# EAGLE design ArduinoUNOGamePlatform (EAGLE 9.4.2)
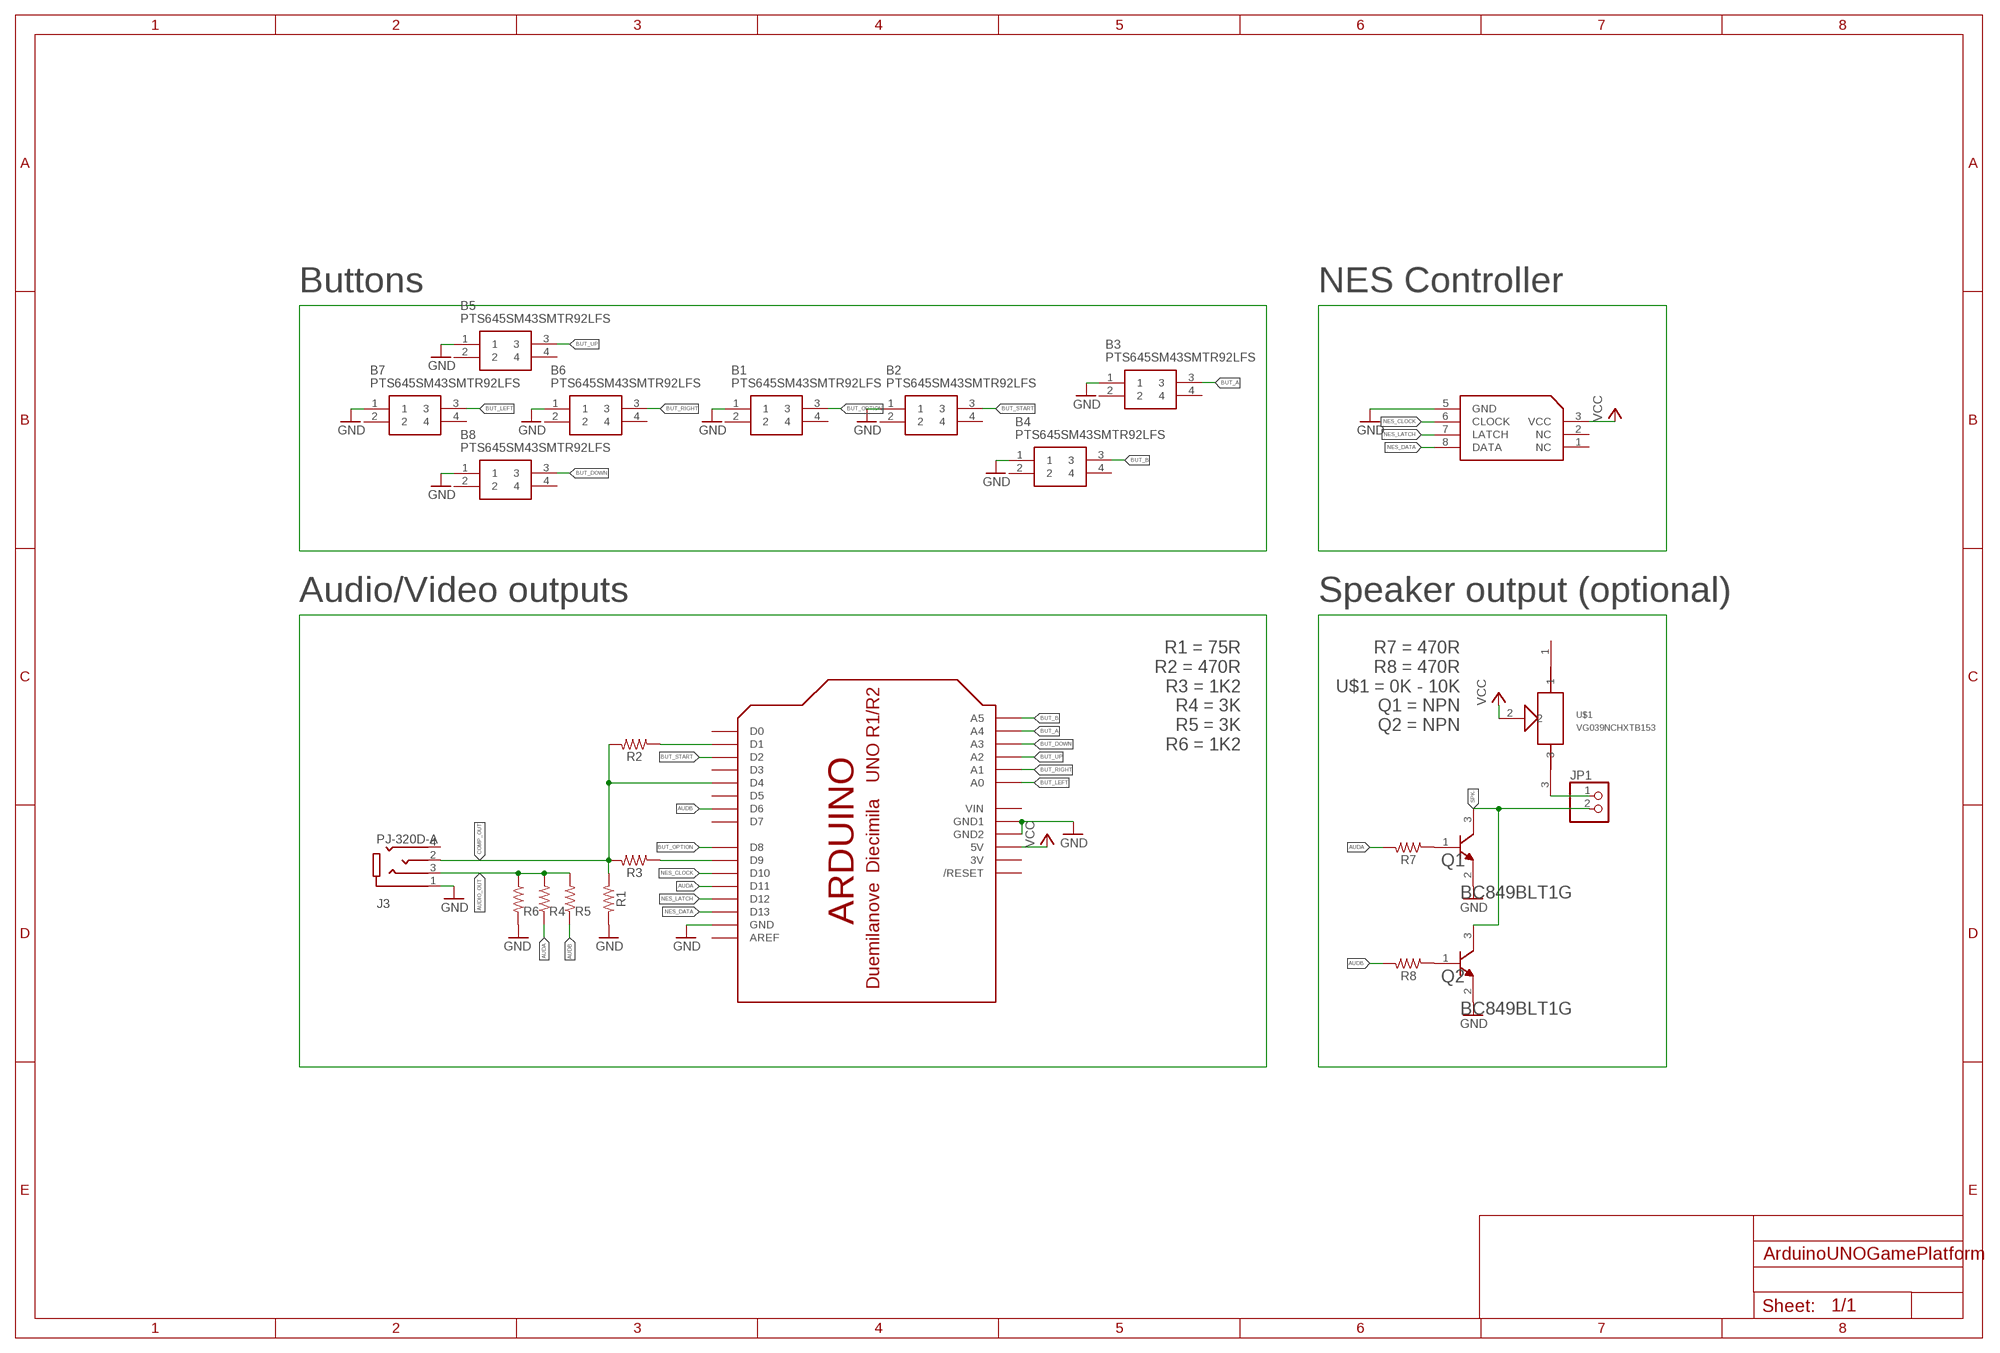
[diagram p0: schematic, sheet 1]

## Parts
B1  PTS645SM43SMTR92LFS  [PTS645(SMT)]
B2  PTS645SM43SMTR92LFS  [PTS645(SMT)]
B3  PTS645SM43SMTR92LFS  [PTS645(SMT)]
B4  PTS645SM43SMTR92LFS  [PTS645(SMT)]
B5  PTS645SM43SMTR92LFS  [PTS645(SMT)]
B6  PTS645SM43SMTR92LFS  [PTS645(SMT)]
B7  PTS645SM43SMTR92LFS  [PTS645(SMT)]
B8  PTS645SM43SMTR92LFS  [PTS645(SMT)]
J3  PJ-320D-A  [HRO_PJ-320D-A]
JP1  PINHD-1X2  [1X02]
Q1  ON_SEMICONDUCTOR_BC849BLT1GON_SEMICONDUCTOR_BC849BLT1G_0_0  [ON_SEMICONDUCTOR_BC849BLT1G_0]
Q2  ON_SEMICONDUCTOR_BC849BLT1GON_SEMICONDUCTOR_BC849BLT1G_0_0  [ON_SEMICONDUCTOR_BC849BLT1G_0]
R1  75R  52101-101-REV-A_RC-MASTER-SMD_R_0603MP  [52101-101-REV-A_RC-MASTER-SMD_R0603MP]
R2  220R  52101-101-REV-A_RC-MASTER-SMD_R_0603MP  [52101-101-REV-A_RC-MASTER-SMD_R0603MP]
R3  1K2  52101-101-REV-A_RC-MASTER-SMD_R_0603MP  [52101-101-REV-A_RC-MASTER-SMD_R0603MP]
R4  3K  52101-101-REV-A_RC-MASTER-SMD_R_0603MP  [52101-101-REV-A_RC-MASTER-SMD_R0603MP]
R5  3K  52101-101-REV-A_RC-MASTER-SMD_R_0603MP  [52101-101-REV-A_RC-MASTER-SMD_R0603MP]
R6  1K2  52101-101-REV-A_RC-MASTER-SMD_R_0603MP  [52101-101-REV-A_RC-MASTER-SMD_R0603MP]
R7  470R  52101-101-REV-A_RC-MASTER-SMD_R_0603MP  [52101-101-REV-A_RC-MASTER-SMD_R0603MP]
R8  470R  52101-101-REV-A_RC-MASTER-SMD_R_0603MP  [52101-101-REV-A_RC-MASTER-SMD_R0603MP]
U$1  VG039NCHXTB153  [VG039NCHXTB101]
U$2  ARDUINO-BPLACE  [ARDUINO-BPLACE]
U$3  NES-CONTROLLER-PORT  [NES-CONTROLLER-SOCKET]

## Nets
AUDA: R4.1 R7.2 U$2.D11
AUDB: R5.1 R8.2 U$2.D6
AUDIO_OUT: J3.3(RING1) R4.2 R5.2 R6.1
BUT_A: B3.3 U$2.A4
BUT_B: B4.3 U$2.A5
BUT_DOWN: B8.3 U$2.A3
BUT_LEFT: B7.3 U$2.A0
BUT_OPTION: B1.3 U$2.D8
BUT_RIGHT: B6.3 U$2.A1
BUT_START: B2.3 U$2.D2
BUT_UP: B5.3 U$2.A2
COMP_OUT: J3.2(TIP) R1.1 R2.2 R3.2 U$2.D4
GND: B1.1 B2.1 B3.1 B4.1 B5.1 B6.1 B7.1 B8.1 J3.1(SLEEVE) Q1.2(E) Q2.2(E) R1.2 R6.2 U$2.GND U$2.GND1 U$2.GND2 U$3.5(GND)
N$1: JP1.1 U$1.3
N$7: Q2.1(B) R8.1
N$8: Q1.1(B) R7.1
NES_CLOCK: U$2.D10 U$3.6(CLOCK)
NES_DATA: U$2.D13 U$3.8(DATA)
NES_LATCH: U$2.D12 U$3.7(LATCH)
SPK-: JP1.2 Q1.3(C) Q2.3(C)
SYNC_OUT: R3.1 U$2.D9
VCC: U$1.2 U$2.5V U$3.3(VCC)
VIDEO_OUT: R2.1 U$2.D1
Unconnected: B1.2 B1.4 B2.2 B2.4 B3.2 B3.4 B4.2 B4.4 B5.2 B5.4 B6.2 B6.4 B7.2 B7.4 B8.2 B8.4 J3.4(RING2) U$1.1 U$2.AREF U$2.D0 U$2.D3 U$2.D5 U$2.D7 U$2.RESET(/RESET) U$3.1(NC) U$3.2(NC)

## Notes on the sheet
- Buttons | NES Controller
- Audio/Video outputs | Speaker output (optional)
- R1 = 75R
  R2 = 470R
  R3 = 1K2
  R4 = 3K
  R5 = 3K
  R6 = 1K2
- R7 = 470R
  R8 = 470R
  U$1 = 0K - 10K
  Q1 = NPN
  Q2 = NPN

## Power pins joined to a net without a drawn wire
3V: U$2.3V
VIN: U$2.VIN

## Library data of the parts
B1-B8 = PTS645SM43SMTR92LFS:PTS645SM43SMTR92LFS: C & K COMPONENTS - PTS645SM43SMTR92LFS - SWITCH, SPST, 0.05A, 12VDC, SMD, 4.3MM Source: Datasheet <http://www.farnell.com/datasheets/1914518.pdf>; DESCRIPTION: C & K COMPONENTS - PTS645SM43SMTR92LFS - SWITCH, SPST, 0.05A, 12VDC, SMD, 4.3MM; HEIGHT: mm; MANUFACTURER_NAME: C & K COMPONENTS; MANUFACTURER_PART_NUMBER: PTS645SM43SMTR92LFS; MOUSER_PART_NUMBER: 611-PTS645SM43SMTR92; MOUSER_PRICE-STOCK: https://www.mouser.com/Search/Refine.aspx?Keyword=611-PTS645SM43SMTR92
J3 = PJ-320D-A:PJ-320D-A: Check availability <https://pricing.snapeda.com/parts/PJ-320D-A/HRO%20Electronics%20Co.%2C%20Ltd./view-part?ref=eda>; AVAILABILITY: Not in stock; CHECK_PRICES: https://www.snapeda.com/parts/PJ-320D-A/HRO+Electronics+Co.%252C+Ltd./view-part/?ref=eda; DESCRIPTION: Headphone jack 0.5A 30V DC 100 mΩ; MF: HRO Electronics Co., Ltd.; MP: PJ-320D-A; PACKAGE: Package; PRICE: None; SNAPEDA_LINK: https://www.snapeda.com/parts/PJ-320D-A/HRO+Electronics+Co.%252C+Ltd./view-part/?ref=snap
JP1 = pinhead:PINHD-1X2: PIN HEADER
Q1 Q2 = On Semiconductor - BC849BLT1G:ON_SEMICONDUCTOR_BC849BLT1G: ONSC-NPN-B1E2C3-3; CIIVA_IDS: 19369299; COMPONENT_LINK_1_DESCRIPTION: Manufacturer URL; COMPONENT_LINK_1_URL: http://www.onsemi.com/; COMPONENT_LINK_3_DESCRIPTION: Package Specification; COMPONENT_LINK_3_URL: http://www.onsemi.cn/pub_link/Collateral/318-08.PDF; DATASHEET: http://www.onsemi.cn/pub_link/Collateral/BC846ALT1-D.PDF; DATASHEET_VERSION: Rev. 11; FOOTPRINT_VARIANT_NAME_0: Manufacturer Recommended; FT_MIN_MHZ: 100; IC_CONTINUOUS_A: 0.1; IMPORTED: yes; IMPORTED_FROM: vault; IMPORT_TS: 1521843736; MF: On Semiconductor; MOUNTING_TECHNOLOGY: Surface Mount; MPN: BC849BLT1G; PACKAGE: SOT-23-3-318-08; PACKAGE_DESCRIPTION: 3-Pin Small Outline Transistor, Body 2.92 x 1.3 mm, Pitch 0.95 mm; PACKAGE_VERSION: Rev. AP, 11/2009; PACKING: Tape and Reel; POLARITY: NPN; PREFIX: Q; RELEASE_DATE: 1406898388; ROHS: Yes; VAULT_GUID: 19D3C7D6-08FD-4A81-9BD4-62C7617130FB; VAULT_REVISION: B4675A61-FAF7-4072-9C56-0A9635A35669
R1-R8 = ESP32_DMX_Audio:52101-101-REV-A_RC-MASTER-SMD_R_: RESISTOR
U$1 = untitled:VG039NCHXTB153
U$2 = adafruit:ARDUINO: Arduino Diecimila/Duemilanove Make a shield with ease, this package has all the named pins as well as the two mounting drill holes and an outline of the USB and DC power connector. The outline is on the DIMENSION layer, so if your board house uses it they will cut the outline to match. http://www.ladyada.net/library/pcb/eaglelibrary.html
U$3 = PJ-320D-A:NES-CONTROLLER-PORT

## Board
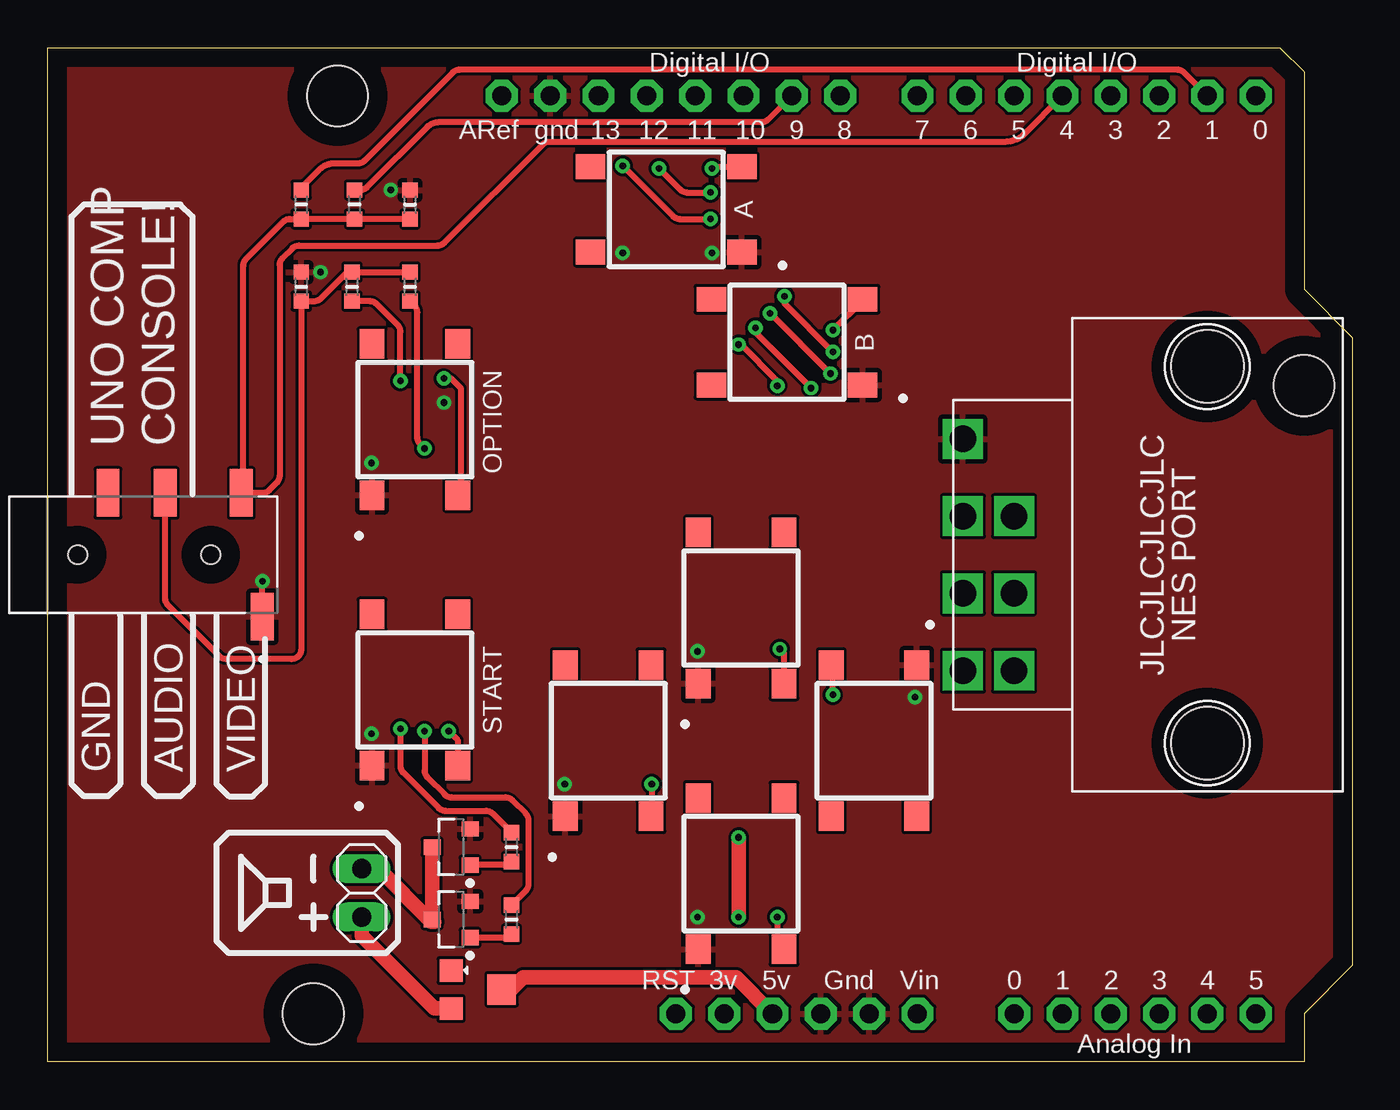
[diagram p1: board, top side]
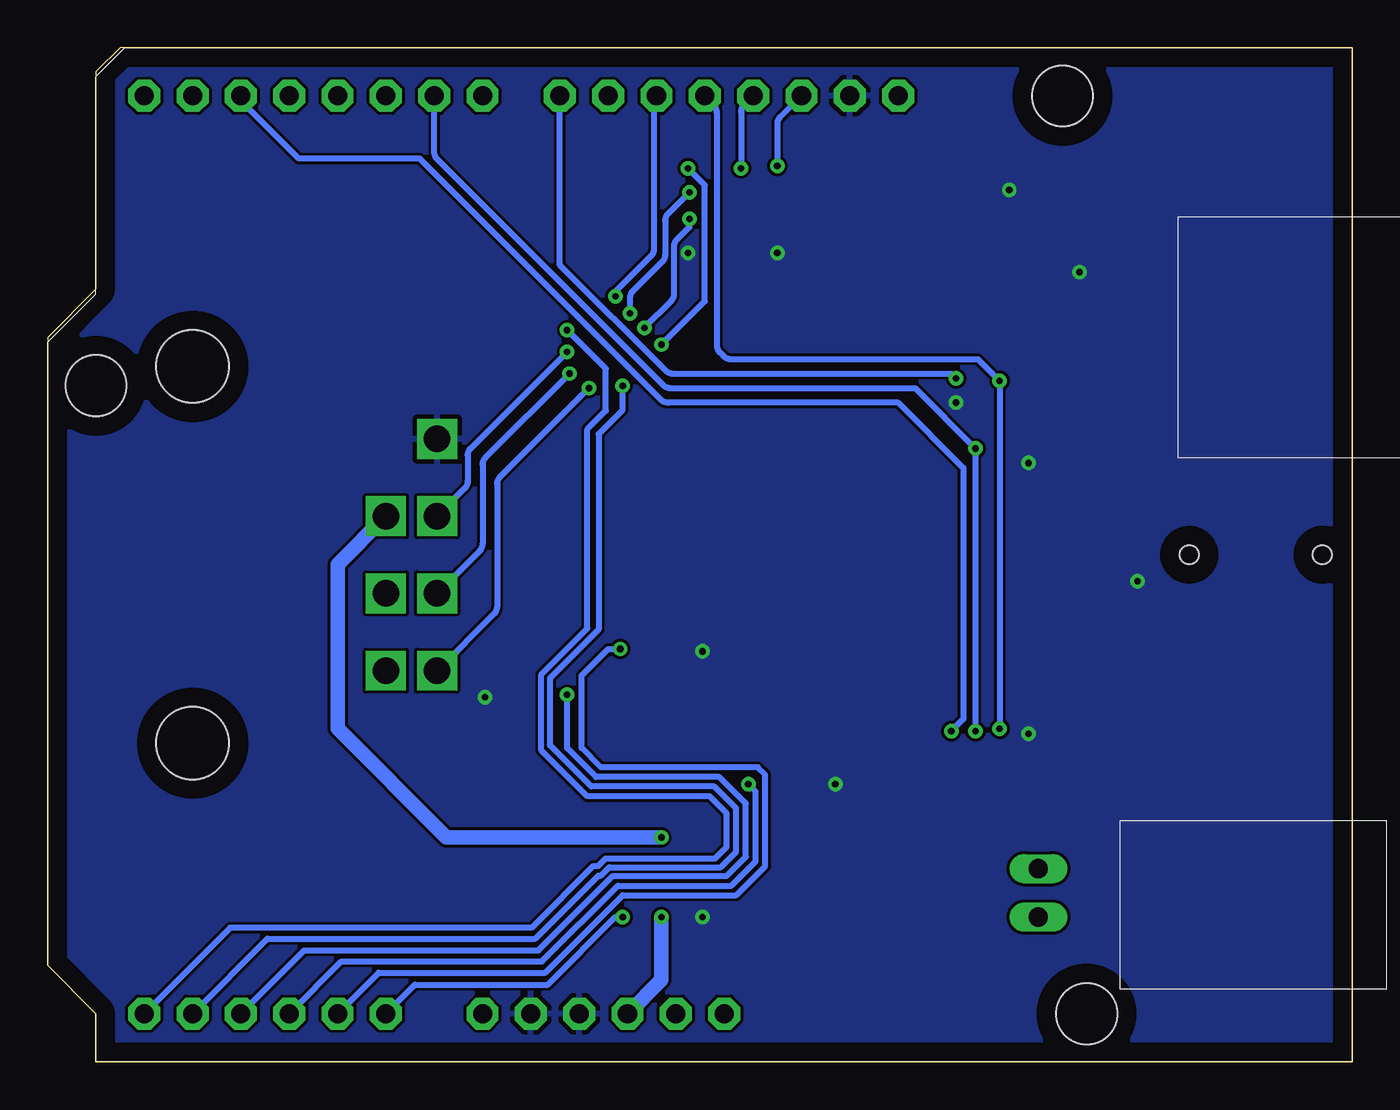
[diagram p2: board, bottom side, seen from below]

Size 68.58 x 53.34 mm. Coordinates in mm from the lower left corner, seen from the top.
Outline: 0,53.34 64.77,53.34 66.04,52.07 66.04,40.64 68.58,38.1 68.58,5.08 66.04,2.54 66.04,0 0,0 0,53.34
Copper layers (1*16): Top 0.035mm / dielectric 0.15mm / Bottom 0.035mm
Design rules "default": minimum track width 6mil, minimum drill 0.35mm, track to track 6mil, track to pad 6mil, pad to pad 6mil, via to via 6mil, smd to smd 6mil, copper to edge 40mil, drill to drill 6mil, minimum pad ring 10mil, minimum via ring 8mil, stop-mask expansion 4mil, vias tented up to drill 0mil, thermal gap 10mil

### Footprints (pad centres in the part's own frame; a part is rotated, then mirrored left to right if it is on the bottom)
PTS645(SMT) = smd 1.55 x 1.3: 1 -3.975,2.25; 2 3.975,2.25; 3 -3.975,-2.25; 4 3.975,-2.25
HRO_PJ-320D-A = smd 1.2 x 2.5: 1 6.2,-3.25; 2 5.1,3.25; 3 1.1,3.25; 4 -1.9,3.25 | hole 1: -3.5,0; 3.5,0
1X02 = drill 1.016 long: 1 -1.27,0; 2 1.27,0
ON_SEMICONDUCTOR_BC849BLT1G_0 = smd 0.9 x 0.8: 1 -1,0.95; 2 -1,-0.95; 3 1,0
52101-101-REV-A_RC-MASTER-SMD_R0603MP = smd 0.8 x 0.8: 1 -0.762,0; 2 0.762,0
VG039NCHXTB101 = smd 1.2 x 1.2: 1 -1,-1.65; 3 1,-1.65 | smd 1.6 x 1.5: 2 0,1
ARDUINO-BPLACE = drill 1 pad 1.676 octagon: 3V 35.56,2.54; 5V 38.1,2.54; A0 50.8,2.54; A1 53.34,2.54; A2 55.88,2.54; A3 58.42,2.54; A4 60.96,2.54; A5 63.5,2.54; AREF 23.876,50.8; D0 63.5,50.8; D1 60.96,50.8; D2 58.42,50.8; D3 55.88,50.8; D4 53.34,50.8; D5 50.8,50.8; D6 48.26,50.8; D7 45.72,50.8; D8 41.656,50.8; D9 39.116,50.8; D10 36.576,50.8; D11 34.036,50.8; D12 31.496,50.8; D13 28.956,50.8; GND 26.416,50.8; GND1 43.18,2.54; GND2 40.64,2.54; RESET 33.02,2.54; VIN 45.72,2.54 | hole 3.2: 15.24,50.8; 66.04,35.56; 13.97,2.54
NES-CONTROLLER-SOCKET = drill 1.4 square: 1 6.096,-10.16; 2 2.032,-10.16; 3 -2.032,-10.16; 5 -6.096,-12.852; 6 -2.032,-12.852; 7 2.032,-12.852; 8 6.096,-12.852 | hole 3.8: -9.906,0; 9.906,0

### Placement (x,y rotation side)
B1  19.3,33.78 90 top
B2  19.3,19.56 90 top
B3  32.51,44.83 180 top
B4  38.86,37.85 180 top
B5  29.46,16.89 90 top
B6  36.45,23.88 90 top
B7  36.45,9.91 90 top
B8  43.43,16.89 270 top
J3  5.08,26.67 0 top
JP1  16.51,8.89 90 top
Q1  21.21,11.3 180 top
Q2  21.21,7.49 180 top
R1  19.05,45.09 90 top
R2  13.34,45.09 270 top
R3  16.13,45.09 270 top
R4  16,40.77 90 top
R5  19.05,40.77 90 top
R6  13.34,40.77 90 top
R7  24.38,11.3 90 top
R8  24.38,7.49 90 top
U$1  22.86,3.81 270 top
U$2  0,0 0 top
U$3  60.96,26.67 270 top

### Tracks (layer width: path | path; a pad name or v marks a point on that pad's centre or on a via)
AUDA  (via drill 0.35)
  Top 0.305: R7.2 23.39,13.06 arc45 23.03,13.21 20.91,13.21 arc-45 20.55,13.36 18.69,15.22 arc-45 18.54,15.58 v18.54,17.53 | v18.54,35.81 18.54,38.4 arc45 18.39,38.76 17.29,39.86 arc45 16.93,40.01 R4.1
  Bottom 0.305: U$2.D11 33.68,50.44 arc45 33.4,49.77 33.4,37.67 arc-45 33.25,37.32 33.04,37.11 arc-45 32.68,36.96 19.68,36.96 v18.54,35.81 v18.54,17.53
AUDB  (via drill 0.35)
  Top 0.305: R8.2 25.12,8.99 arc45 25.27,9.35 25.27,12.71 arc45 25.12,13.06 24.42,13.76 arc45 24.07,13.91 21.22,13.91 arc-45 20.86,14.06 19.96,14.96 arc-45 19.81,15.32 v19.81,17.4 | v19.81,32.26 19.58,32.49 arc-45 19.43,32.85 19.43,39.41 arc45 19.28,39.77 R5.1
  Bottom 0.305: U$2.D6 48.26,47.84 arc-45 48.11,47.48 36.22,35.58 arc-45 35.86,35.43 22.99,35.43 v19.81,32.26 v19.81,17.4
AUDIO_OUT
  Top 0.305: J3.3 6.18,24.38 arc45 6.33,24.02 9.01,21.34 arc45 9.37,21.19 12.83,21.19 arc90 13.34,21.7 R6.1 14.01,40.01 arc45 14.37,40.15 15.75,41.53 R4.2 R5.2
BUT_A  (via drill 0.35)
  Top 0.305: v38.35,35.56 38.35,35.81 36.45,37.72 v36.32,37.72 | v34.92,46.99 35.02,47.08 B3.3
  Bottom 0.305: U$2.A4 57.02,6.48 42.95,6.48 39.64,9.79 39.51,9.79 39.06,10.24 33.19,10.24 32.38,11.05 32.38,13.34 33.53,14.48 40.01,14.48 42.16,16.64 42.16,20.19 39.62,22.73 39.62,33.02 38.35,34.29 v38.35,35.56 | v34.92,46.99 34.04,46.1 34.04,40.01 v36.32,37.72
BUT_B  (via drill 0.35)
  Top 0.305: B4.3 42.84,40.04 v41.27,38.48
  Bottom 0.305: U$2.A5 58.98,7.06 43.14,7.06 39.9,10.3 39.64,10.3 39.25,10.7 33.5,10.7 32.89,11.3 32.89,13.08 33.78,13.97 40.21,13.97 42.62,16.38 42.62,20.38 40.21,22.8 40.21,33.27 39.24,34.24 39.24,36.45 v41.27,38.48
BUT_DOWN  (via drill 0.35)
  Top 0.305: v41.27,19.3 41.27,20.77 B8.3
  Bottom 0.305: U$2.A3 55.09,5.87 42.78,5.87 38.87,9.79 32.89,9.79 31.88,10.79 31.88,13.59 33.27,14.99 39.75,14.99 41.27,16.51 v41.27,19.3
BUT_LEFT  (via drill 0.35)
  Top 0.305: v38.35,7.62 38.35,6.28 B7.3
  Bottom 0.305: U$2.A0 49.28,4.06 42.29,4.06 38.73,7.62 v38.35,7.62
BUT_OPTION  (via drill 0.35)
  Top 0.305: v20.83,35.94 21.21,35.94 21.72,35.43 21.72,29.97 B1.3
  Bottom 0.305: v20.83,35.94 21.08,36.2 35.73,36.2 arc45 36.09,36.34 41.66,41.91 U$2.D8
BUT_RIGHT  (via drill 0.35)
  Top 0.305: v38.48,21.72 38.7,21.5 B6.3
  Bottom 0.305: U$2.A1 51.18,4.7 42.42,4.7 38.35,8.76 32.38,8.76 30.86,10.29 30.86,15.11 31.24,15.49 39.5,15.49 40.51,16.51 40.51,20.32 39.12,21.72 v38.48,21.72
BUT_START  (via drill 0.35)
  Top 0.305: v21.08,17.4 21.55,16.93 B2.3
  Bottom 0.305: U$2.D2 58.42,50.55 55.37,47.5 49.02,47.5 36.34,34.82 arc-45 35.98,34.67 23.88,34.67 20.45,31.24 20.45,18.03 v21.08,17.4
BUT_UP  (via drill 0.35)
  Top 0.305: v31.75,14.61 31.75,12.95 B5.3
  Bottom 0.305: U$2.A2 53.14,5.28 42.6,5.28 38.61,9.27 32.64,9.27 31.37,10.54 31.37,14.22 v31.75,14.61
COMP_OUT
  Top 0.305: R1.1 R3.2 R2.2 12.74,44.32 arc45 12.38,44.17 10.44,42.23 arc45 10.29,41.87 10.29,30.03 J3.2 11.29,29.92 arc45 11.65,30.07 12.04,30.46 arc45 12.19,30.82 12.19,41.9 arc-45 12.34,42.26 12.86,42.78 arc-45 13.21,42.93 20.49,42.93 arc45 20.85,43.08 26.01,48.24 arc-45 26.37,48.39 50.36,48.39 arc45 51.33,48.79 U$2.D4
GND  (via drill 0.35)
  Top 0.305: J3.1 11.28,25.25 v11.3,25.27
  other vias: 17.02,31.5 20.83,34.67 18.03,45.85 34.92,42.55 17.02,17.27 34.16,21.59 27.18,14.61 45.59,19.18 34.16,7.62 14.35,41.53 30.23,42.55
  pour Bottom: -2.54,54.61 72.39,54.61 72.39,-3.81 -2.54,-3.81
  pour Top: -2.54,54.61 72.39,54.61 72.39,-3.81 -2.54,-3.81
N$1
  Top 0.762: U$1.3 20.32,2.81 16.51,6.62 JP1.1
N$7
  Top 0.305: Q2.1 24.2,6.54 R8.1
N$8
  Top 0.305: R7.1 24.2,10.35 Q1.1
NES_CLOCK  (via drill 0.35)
  Top 0.305: v38.73,40.26 38.73,39.88 v41.27,37.34
  Bottom 0.305: U$2.D10 36.7,50.67 36.7,42.76 arc45 36.85,42.4 38.73,40.51 v38.73,40.26 | U$3.6 46.65,30.17 arc-45 46.5,30.53 46.5,31.9 arc45 46.35,32.26 v41.27,37.34
NES_DATA  (via drill 0.35)
  Top 0.305: v30.23,47.12 32.87,44.47 arc45 33.23,44.32 v34.85,44.32 | v40.13,35.43 37.21,38.35 v37.21,38.61
  Bottom 0.305: U$2.D13 30.08,49.68 arc-45 30.23,49.32 v30.23,47.12 | v34.85,44.32 34.85,43.89 35.51,43.23 arc-45 35.66,42.87 35.66,40.37 arc45 35.81,40.01 v37.21,38.61 | v40.13,35.43 44.81,30.76 arc-45 44.96,30.4 44.96,23.93 arc45 45.11,23.57 U$3.8
NES_LATCH  (via drill 0.35)
  Top 0.305: v32.13,46.99 33.25,45.87 arc45 33.61,45.72 v34.85,45.72 | v37.97,39.37 v41.15,36.2
  Bottom 0.305: U$2.D12 31.98,50.31 arc-45 32.13,49.95 v32.13,46.99 | v34.85,45.72 35.97,44.6 arc-45 36.12,44.24 36.12,42.44 arc45 36.27,42.08 37.82,40.52 arc-45 37.97,40.16 v37.97,39.37 | v41.15,36.2 45.57,31.77 arc-45 45.72,31.41 45.72,27.24 arc45 45.87,26.88 U$3.7
SPK-
  Top 0.508: 20.32,7.38 Q2.3
  Top 0.762: Q1.3 Q2.3 | 20.32,7.38 20.18,7.38 17.4,10.16 JP1.2
SYNC_OUT
  Top 0.305: R3.1 16.43,45.85 arc45 16.79,46 19.95,49.16 arc-45 20.53,49.4 37.51,49.4 arc45 37.87,49.55 U$2.D9
VCC  (via drill 0.35)
  Top 0.762: U$2.5V 36.2,4.45 25,4.45 24.37,3.81 U$1.2 | v36.32,7.62 v36.32,11.81
  Bottom 0.762: U$2.5V 36.32,4.32 v36.32,7.62 | v36.32,11.81 47.62,11.81 53.34,17.53 53.34,26.16 U$3.3
VIDEO_OUT
  Top 0.305: R2.1 13.34,45.97 14.28,46.92 arc-45 15.07,47.24 16.3,47.24 arc45 16.66,47.39 21.29,52.02 arc-45 21.65,52.17 59.38,52.17 arc-45 59.74,52.02 U$2.D1

### Text on the board
tPlace: A | B | OPTION | UNO COMP / CONSOLE! | JLCJLCJLCJLC | START | GND | AUDIO | VIDEO